# EAGLE schematic Stromlaufplan_Platine v18 (EAGLE 9.7.0)

## Sheet 1 of 2
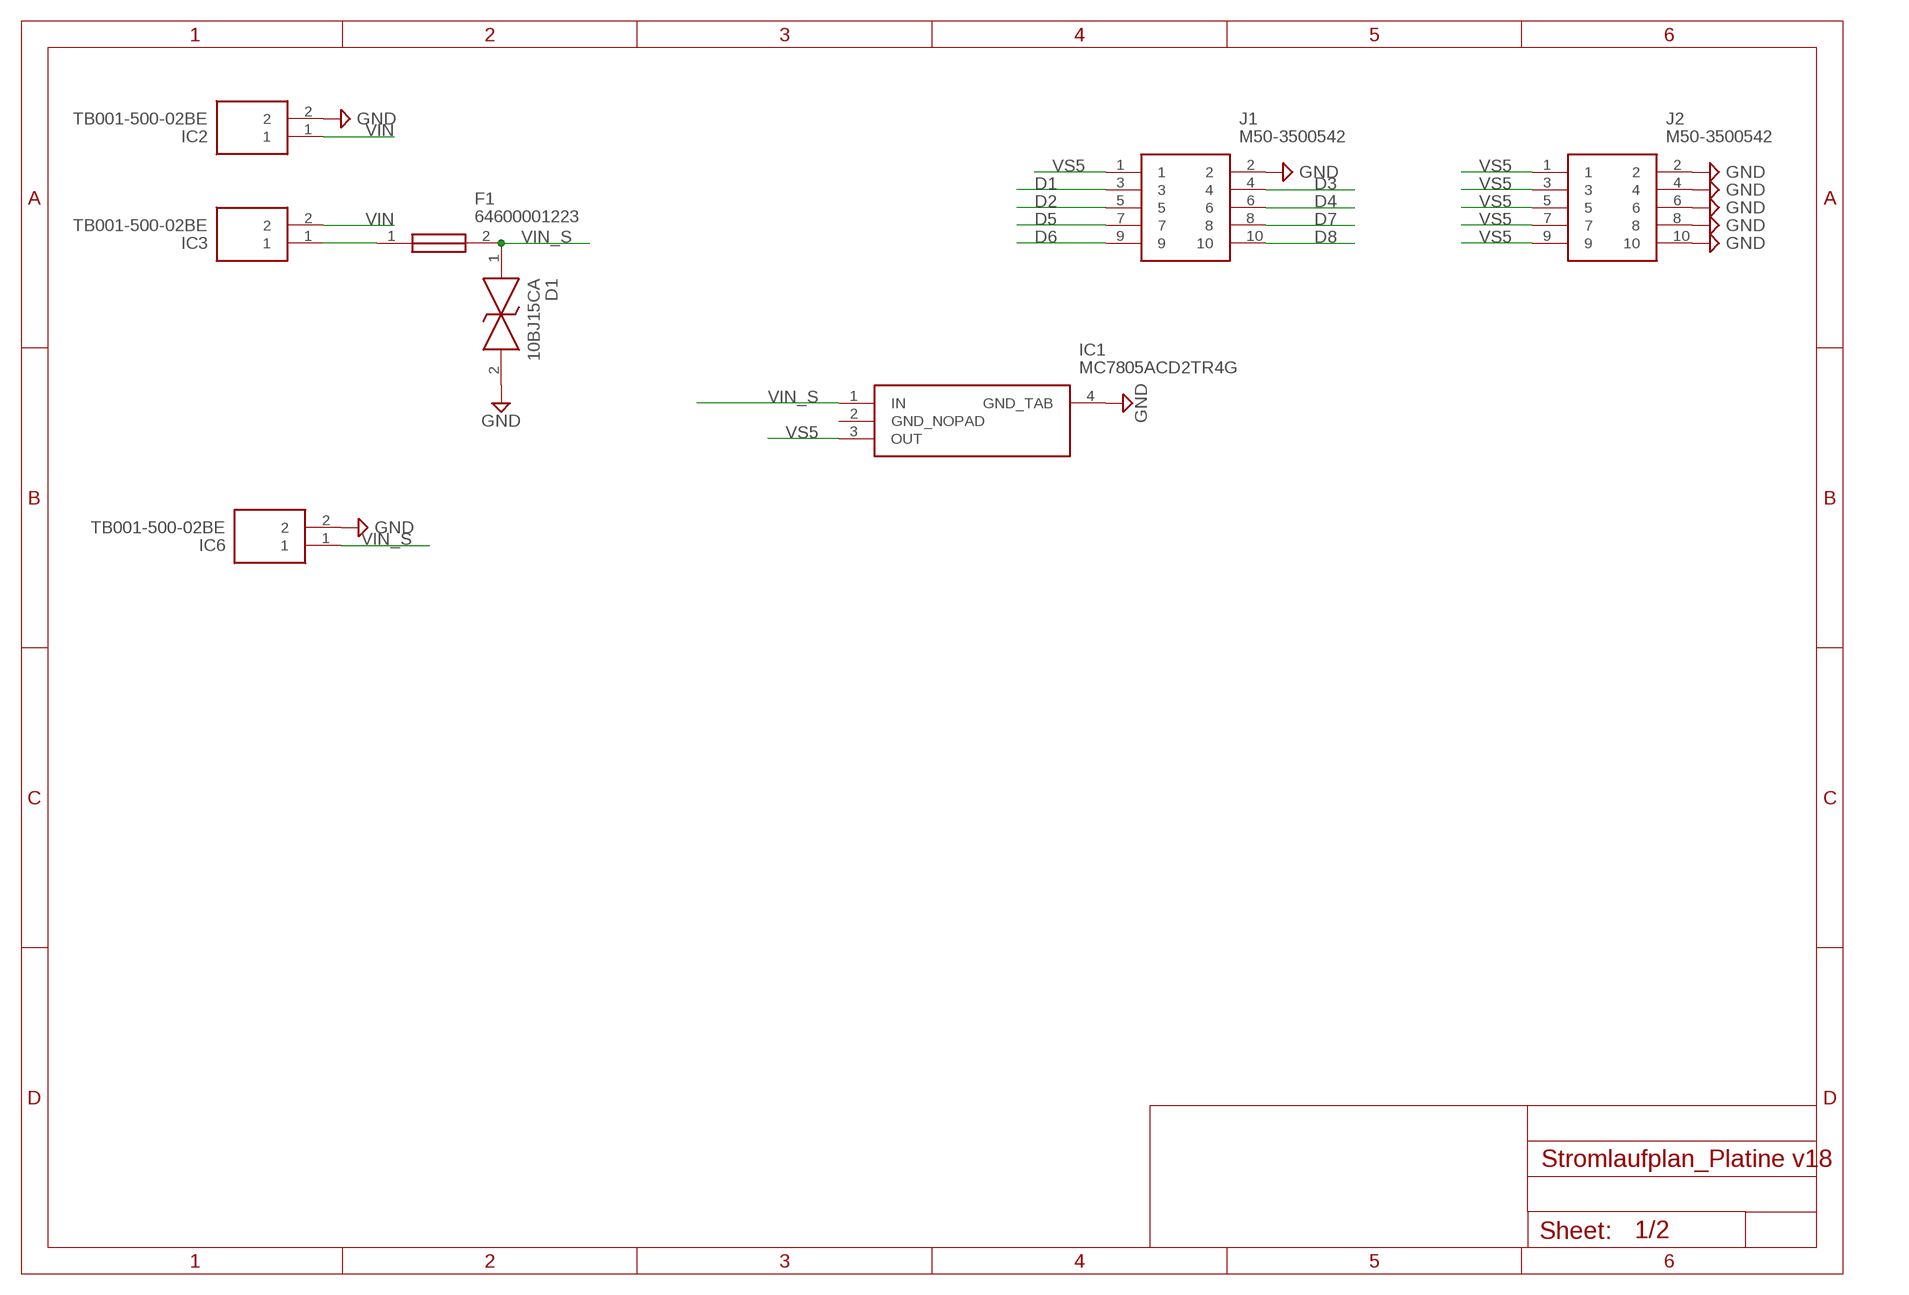
[diagram p0: schematic, sheet 1]

### Parts
D1  10BJ15CA  [10BJ15CA]
F1  64600001223  [64600001223]
IC1  MC7805ACD2TR4G  [TO254P1420X457-4N]
IC2  TB001-500-02BE  [TB00150002BE]
IC3  TB001-500-02BE  [TB00150002BE]
IC6  TB001-500-02BE  [TB00150002BE]
J1  M50-3500542  [M503500542]
J2  M50-3500542  [M503500542]

### Nets
D1 [Steuerung]: J1.3 ; also sheet 2
D2 [Steuerung]: J1.5 ; also sheet 2
D3 [Steuerung]: J1.4 ; also sheet 2
D4 [Steuerung]: J1.6 ; also sheet 2
D5 [Steuerung]: J1.7 ; also sheet 2
D6 [Steuerung]: J1.9 ; also sheet 2
D7 [Steuerung]: J1.8 ; also sheet 2
D8 [Steuerung]: J1.10 ; also sheet 2
GND: D1.2 IC1.4(GND_TAB) IC2.2 IC6.2 J1.2 J2.2 J2.4 J2.6 J2.8 J2.10 ; also sheet 2
N$1: F1.1 IC3.1
VIN [Leistung]: IC2.1 IC3.2
VIN_S: D1.1 F1.2 IC1.1(IN) IC6.1 ; also sheet 2
VS5 [Steuerung]: IC1.3(OUT) J1.1 J2.1 J2.3 J2.5 J2.7 J2.9

## Sheet 2 of 2
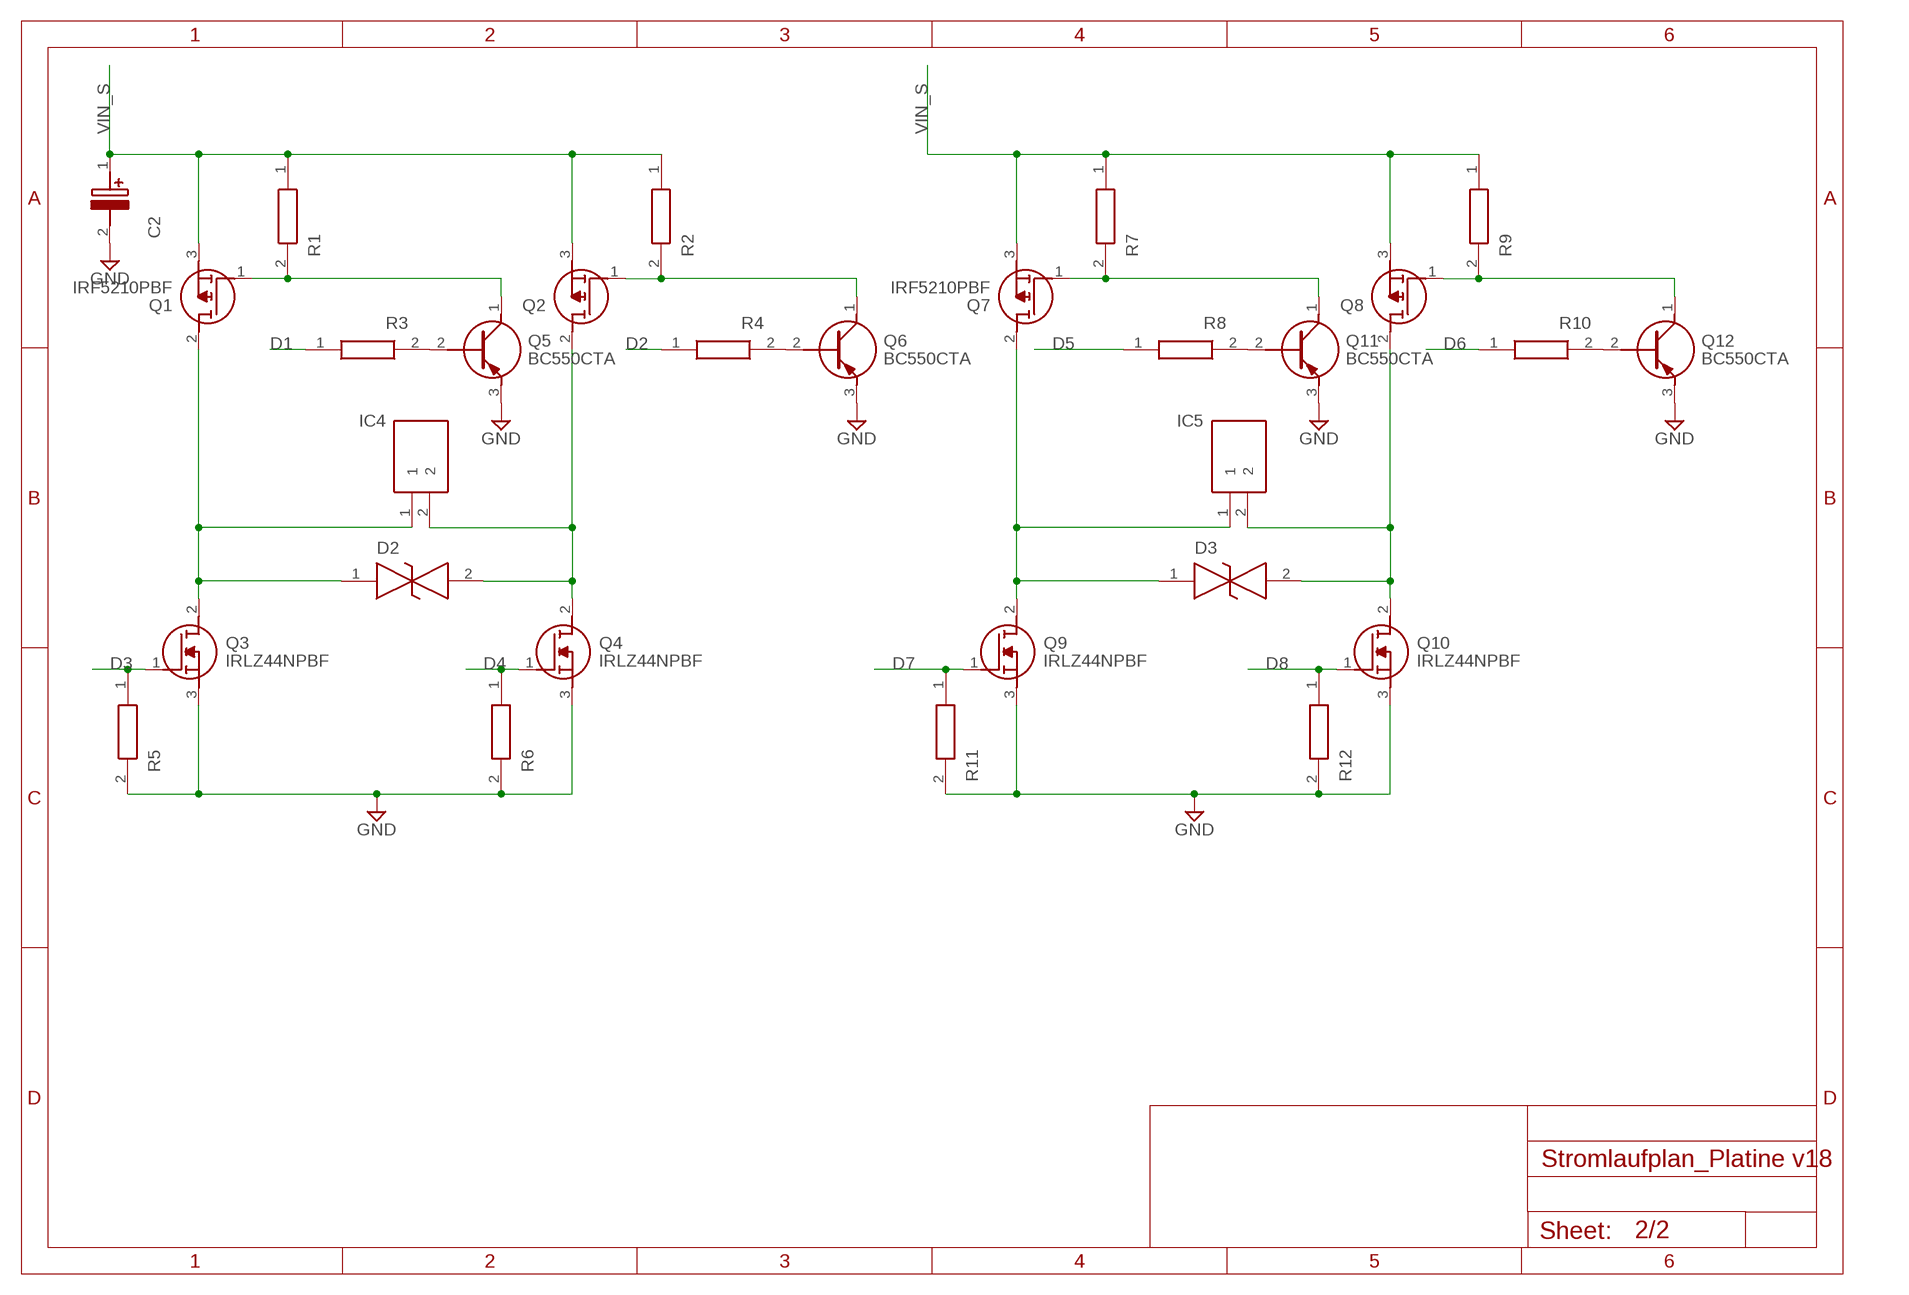
[diagram p1: schematic, sheet 2]

### Parts
C2  860020474014  [CAPPRD350W52D800H1300]
D2  10BJ15CA  [10BJ15CA]
D3  10BJ15CA  [10BJ15CA]
IC4  TB001-500-02BE  [TB00150002BE]
IC5  TB001-500-02BE  [TB00150002BE]
Q1  IRF5210PBF  [TO254P469X1042X1967-3P]
Q2  IRF5210PBF  [TO254P469X1042X1967-3P]
Q3  IRLZ44NPBF  [TO254P469X1042X1967-3P]
Q4  IRLZ44NPBF  [TO254P469X1042X1967-3P]
Q5  BC550CTA  [KA431AZTA]
Q6  BC550CTA  [KA431AZTA]
Q7  IRF5210PBF  [TO254P469X1042X1967-3P]
Q8  IRF5210PBF  [TO254P469X1042X1967-3P]
Q9  IRLZ44NPBF  [TO254P469X1042X1967-3P]
Q10  IRLZ44NPBF  [TO254P469X1042X1967-3P]
Q11  BC550CTA  [KA431AZTA]
Q12  BC550CTA  [KA431AZTA]
R1  CRMA1206AF10K0DKEF  [RESC3216X74N]
R2  CRMA1206AF10K0DKEF  [RESC3216X74N]
R3  CRMA1206AF10K0DKEF  [RESC3216X74N]
R4  CRMA1206AF10K0DKEF  [RESC3216X74N]
R5  CRMA1206AF10K0DKEF  [RESC3216X74N]
R6  CRMA1206AF10K0DKEF  [RESC3216X74N]
R7  CRMA1206AF10K0DKEF  [RESC3216X74N]
R8  CRMA1206AF10K0DKEF  [RESC3216X74N]
R9  CRMA1206AF10K0DKEF  [RESC3216X74N]
R10  CRMA1206AF10K0DKEF  [RESC3216X74N]
R11  CRMA1206AF10K0DKEF  [RESC3216X74N]
R12  CRMA1206AF10K0DKEF  [RESC3216X74N]

### Nets
D1 [Steuerung]: R3.1 ; also sheet 1
D2 [Steuerung]: R4.1 ; also sheet 1
D3 [Steuerung]: Q3.1(G) R5.1 ; also sheet 1
D4 [Steuerung]: Q4.1(G) R6.1 ; also sheet 1
D5 [Steuerung]: R8.1 ; also sheet 1
D6 [Steuerung]: R10.1 ; also sheet 1
D7 [Steuerung]: Q9.1(G) R11.1 ; also sheet 1
D8 [Steuerung]: Q10.1(G) R12.1 ; also sheet 1
GND: C2.2(-) Q3.3(S) Q4.3(S) Q5.3(E) Q6.3(E) Q9.3(S) Q10.3(S) Q11.3(E) Q12.3(E) R5.2 R6.2 R11.2 R12.2 ; also sheet 1
N$2: Q1.1(G) Q5.1(C) R1.2
N$3 [Steuerung]: Q5.2(B) R3.2
N$4: Q2.1(G) Q6.1(C) R2.2
N$5 [Steuerung]: Q6.2(B) R4.2
N$6: D2.2 IC4.2 Q2.2(D) Q4.2(D)
N$7: D2.1 IC4.1 Q1.2(D) Q3.2(D)
N$8: Q7.1(G) Q11.1(C) R7.2
N$9 [Steuerung]: Q11.2(B) R8.2
N$10: Q8.1(G) Q12.1(C) R9.2
N$11 [Steuerung]: Q12.2(B) R10.2
N$12: D3.2 IC5.2 Q8.2(D) Q10.2(D)
N$13: D3.1 IC5.1 Q7.2(D) Q9.2(D)
VIN_S: C2.1(+) Q1.3(S) Q2.3(S) Q7.3(S) Q8.3(S) R1.1 R2.1 R7.1 R9.1 ; also sheet 1

## Power pins joined to a net without a drawn wire
GND_NOPAD: IC1.2(GND_NOPAD)

## Library data of the parts
C2 = SamacSys_Parts:860020474014: Wurth Elektronik 470uF 25 V dc Aluminium Electrolytic Capacitor, WCAP-ATG5 Series 2000h 8 (Dia.) x 11.5mm Source: Datasheet <https://componentsearchengine.com/Datasheets/2/860020474014.pdf>; DESCRIPTION: Wurth Elektronik 470uF 25 V dc Aluminium Electrolytic Capacitor, WCAP-ATG5 Series 2000h 8 (Dia.) x 11.5mm; HEIGHT: 13mm; MANUFACTURER_NAME: Wurth Elektronik; MANUFACTURER_PART_NUMBER: 860020474014; MOUSER_PART_NUMBER: 710-860020474014; MOUSER_PRICE-STOCK: https://www.mouser.co.uk/ProductDetail/Wurth-Elektronik/860020474014?qs=0KOYDY2FL2%252BfCDf5E%252Bq6Tw%3D%3D
D1-D3 = SamacSys_Parts:10BJ15CA: 24.4V Clamp 41A Ipp Tvs Diode Surface Mount SMB Source: Datasheet <https://www.eaton.com/content/dam/eaton/products/electronic-components/resources/data-sheet/eaton-10bj-tvs-diode-power-esd-suppressor-data-sheet.pdf>; DESCRIPTION: 24.4V Clamp 41A Ipp Tvs Diode Surface Mount SMB; HEIGHT: 2.4mm; MANUFACTURER_NAME: Eaton; MANUFACTURER_PART_NUMBER: 10BJ15CA
F1 = SamacSys_Parts:64600001223: LITTELFUSE - 64600001223 - FUSE BLOCK, 5X20MM, THROUGH HOLE Source: Datasheet <https://m.littelfuse.com/~/media/electronics/datasheets/fuse_blocks/littelfuse_fuse_block_646_datasheet.pdf.pdf>; DESCRIPTION: LITTELFUSE - 64600001223 - FUSE BLOCK, 5X20MM, THROUGH HOLE; HEIGHT: 12mm; MANUFACTURER_NAME: LITTELFUSE; MANUFACTURER_PART_NUMBER: 64600001223; MOUSER_PART_NUMBER: 576-64600001223; MOUSER_PRICE-STOCK: https://www.mouser.co.uk/ProductDetail/Littelfuse/64600001223?qs=up76HT6PtJjfTS5uVso6wg%3D%3D
IC1 = Custom Libary:MC7805ACD2TR4G: Source: Datasheet <http://www.onsemi.com/pub/Collateral/MC7800-D.PDF>; HEIGHT: 4.572mm; MANUFACTURER_NAME: onsemi; MANUFACTURER_PART_NUMBER: MC7805ACD2TR4G; MOUSER_PART_NUMBER: 863-MC7805ACD2TR4G; MOUSER_PRICE-STOCK: https://www.mouser.co.uk/ProductDetail/onsemi/MC7805ACD2TR4G?qs=%252B9%2Fcbd0IE0T86FFku%252BN0%2FA%3D%3D
IC2-IC6 = SamacSys_Parts:TB001-500-02BE: Fixed Terminal Blocks screw type, 5.00, horizontal, 2 poles, CUI Blue, slotted screw, PCB mount Source: Datasheet <https://datasheet.datasheetarchive.com/originals/distributors/Datasheets_SAMA/b931254781d34eecaec474c4ccd45807.pdf>; DESCRIPTION: Fixed Terminal Blocks screw type, 5.00, horizontal, 2 poles, CUI Blue, slotted screw, PCB mount; HEIGHT: 12.9mm; MANUFACTURER_NAME: CUI Inc.; MANUFACTURER_PART_NUMBER: TB001-500-02BE; MOUSER_PART_NUMBER: 490-TB001-500-02BE; MOUSER_PRICE-STOCK: https://www.mouser.co.uk/ProductDetail/CUI-Devices/TB001-500-02BE?qs=vLWxofP3U2zBBnHgU5u3DA%3D%3D
J1 J2 = SamacSys_Parts:M50-3500542: Header 2x5way DIL VERT Pin HARWIN M50-35 Series, 1.27mm Pitch 10 Way 2 Row Straight PCB Header, Solder Termination, 1A Source: Datasheet <https://datasheet.datasheetarchive.com/originals/distributors/SFDatasheet-1/sf-00022684.pdf>; DESCRIPTION: Header 2x5way DIL VERT Pin HARWIN M50-35 Series, 1.27mm Pitch 10 Way 2 Row Straight PCB Header, Solder Termination, 1A; HEIGHT: 4.15mm; MANUFACTURER_NAME: Harwin; MANUFACTURER_PART_NUMBER: M50-3500542; MOUSER_PART_NUMBER: 855-M50-3500542; MOUSER_PRICE-STOCK: https://www.mouser.co.uk/ProductDetail/Harwin/M50-3500542?qs=9fQaSFfsqsyXI0P9tFOVoQ%3D%3D
Q1 Q2 Q7 Q8 = Custom Libary:IRF5210PBF: MOSFET P-Channel 100V 40A TO220AB Infineon IRF5210PBF P-channel MOSFET Transistor, 40 A, 100 V, 3-Pin TO-220AB Source: Datasheet <https://datasheet.datasheetarchive.com/originals/distributors/Datasheets_SAMA/282f86ced5e538d8a52fd01096578d56.pdf>; DESCRIPTION: MOSFET P-Channel 100V 40A TO220AB Infineon IRF5210PBF P-channel MOSFET Transistor, 40 A, 100 V, 3-Pin TO-220AB; HEIGHT: 4.69mm; MANUFACTURER_NAME: Infineon; MANUFACTURER_PART_NUMBER: IRF5210PBF; MOUSER_PART_NUMBER: 942-IRF5210PBF; MOUSER_PRICE-STOCK: https://www.mouser.co.uk/ProductDetail/Infineon-IR/IRF5210PBF?qs=9%252BKlkBgLFf3S3YiL4ijtLg%3D%3D
Q3 Q4 Q9 Q10 = Custom Libary:IRLZ44NPBF: N-channel MOSFET,IRLZ44N 47A 55V Source: Datasheet <http://www.irf.com/product-info/datasheets/data/irlz44n.pdf>; DESCRIPTION: N-channel MOSFET,IRLZ44N 47A 55V; HEIGHT: 4.69mm; MANUFACTURER_NAME: Infineon; MANUFACTURER_PART_NUMBER: IRLZ44NPBF; MOUSER_PART_NUMBER: 942-IRLZ44NPBF; MOUSER_PRICE-STOCK: https://www.mouser.co.uk/ProductDetail/Infineon-IR/IRLZ44NPBF?qs=9%252BKlkBgLFf15OZZk%252BD0ibg%3D%3D
Q5 Q6 Q11 Q12 = SamacSys_Parts:BC550CTA: Bipolar Transistors - BJT NPN 45V 100mA HFE/800 Source: Datasheet <https://www.onsemi.com/pub/Collateral/BC550-D.pdf>; DESCRIPTION: Bipolar Transistors - BJT NPN 45V 100mA HFE/800; HEIGHT: 5.33mm; MANUFACTURER_NAME: onsemi; MANUFACTURER_PART_NUMBER: BC550CTA; MOUSER_PART_NUMBER: 512-BC550CTA; MOUSER_PRICE-STOCK: https://www.mouser.co.uk/ProductDetail/ON-Semiconductor-Fairchild/BC550CTA/?qs=ljbEvF4DwOM46%2Fg9NzWlqQ%3D%3D
R1-R12 = SamacSys_Parts:CRMA1206AF10K0DKEF: Thick Film Resistors - SMD 0.30W 10Kohm .5% AEC-Q200 Source: Datasheet <https://www.vishay.com/docs/68043/crma.pdf>; DESCRIPTION: Thick Film Resistors - SMD 0.30W 10Kohm .5% AEC-Q200; HEIGHT: 0.74mm; MANUFACTURER_NAME: Vishay; MANUFACTURER_PART_NUMBER: CRMA1206AF10K0DKEF; MOUSER_PART_NUMBER: 71-CRMA1206AF10K0DKF; MOUSER_PRICE-STOCK: https://www.mouser.co.uk/ProductDetail/Vishay/CRMA1206AF10K0DKEF?qs=QNEnbhJQKvbmEa6uzWLn8A%3D%3D

## Net classes
1 Leistung: width 2.032 mm
2 Steuerung: width 0.152 mm